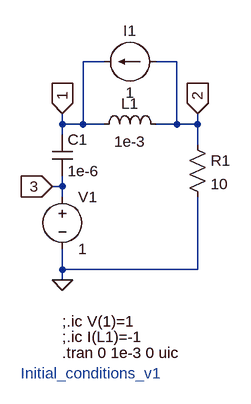
[diagram p0: schematic Initial_conditions_v1.asc]
Initial_conditions_v1.asc, the LTspice schematic file:
Version 4
SHEET 1 880 680
WIRE 192 -96 160 -96
WIRE 304 -96 272 -96
WIRE 128 0 128 -16
WIRE 160 0 160 -96
WIRE 160 0 128 0
WIRE 192 0 160 0
WIRE 304 0 304 -96
WIRE 304 0 272 0
WIRE 336 0 336 -16
WIRE 336 0 304 0
WIRE 128 16 128 0
WIRE 336 32 336 0
WIRE 128 96 128 80
WIRE 128 96 112 96
WIRE 128 112 128 96
WIRE 128 224 128 192
WIRE 336 224 336 112
WIRE 336 224 128 224
WIRE 128 240 128 224
FLAG 128 240 0
FLAG 128 -16 1
IOPIN 128 -16 In
FLAG 336 -16 2
IOPIN 336 -16 In
FLAG 112 96 3
IOPIN 112 96 In
SYMBOL ind 176 16 R270
WINDOW 0 32 56 VTop 2
WINDOW 3 5 56 VBottom 2
SYMATTR InstName L1
SYMATTR Value 1e-3
SYMATTR SpiceLine Rser=0
SYMBOL cap 112 16 R0
SYMATTR InstName C1
SYMATTR Value 1e-6
SYMBOL res 320 16 R0
SYMATTR InstName R1
SYMATTR Value 10
SYMBOL voltage 128 96 R0
SYMATTR InstName V1
SYMATTR Value 1
SYMBOL current 272 -96 R90
WINDOW 0 -32 40 VBottom 2
WINDOW 3 32 40 VTop 2
SYMATTR InstName I1
SYMATTR Value 1
TEXT 128 304 Left 2 !;.ic V(1)=1
TEXT 128 352 Left 2 !.tran 0 1e-3 0 uic
TEXT 64 384 Left 2 ;Initial_conditions_v1
TEXT 128 328 Left 2 !;.ic I(L1)=-1

The netlist it stands for:
* Initial_conditions_v1.asc
L1 1 2 1e-3 Rser=0
C1 1 3 1e-6
R1 2 0 10
V1 3 0 1
I1 2 1 1
;.ic V(1)=1
.tran 0 1e-3 0 uic
* Initial_conditions_v1
;.ic I(L1)=-1
.backanno
.end